# Altium schematic sheet Current_Sensor.SchDoc
size A4; SheetNumber: 4; SheetTotal: 5
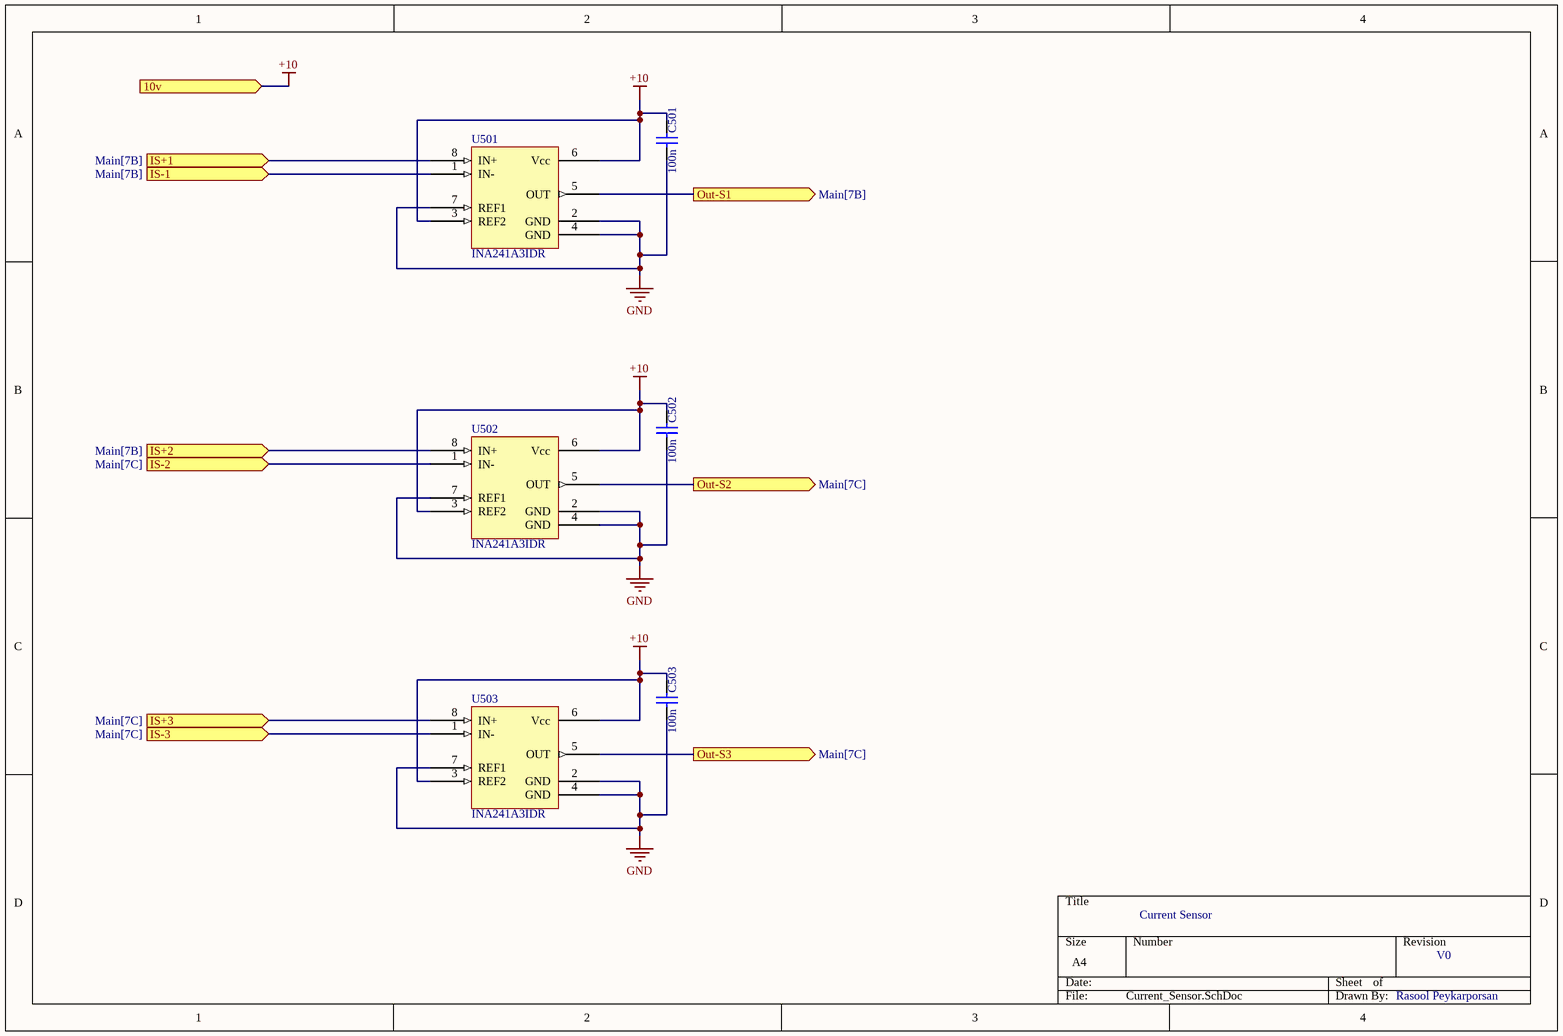
[diagram p0: Current_Sensor.SchDoc]

## Parts
C501  100n  [CAP_1206]
C502  100n  [CAP_1206]
C503  100n  [CAP_1206]
U501  INA241A3IDR  [8SOIC-M]
U502  INA241A3IDR  [8SOIC-M]
U503  INA241A3IDR  [8SOIC-M]

## Ports
10v (in), IS+1 (in, see Main[7B]), IS+2 (in, see Main[7B]), IS+3 (in, see Main[7C]), IS-1 (in, see Main[7B]), IS-2 (in, see Main[7C]), IS-3 (in, see Main[7C]), Out-S1 (out, see Main[7B]), Out-S2 (out, see Main[7C]), Out-S3 (out, see Main[7C])

## Nets
+10: C501.2 C502.2 C503.2 U501.3(REF2) U501.6(Vcc) U502.3(REF2) U502.6(Vcc) U503.3(REF2) U503.6(Vcc) ; port 10v
GND: C501.1 C502.1 C503.1 U501.2(GND) U501.4(GND) U501.7(REF1) U502.2(GND) U502.4(GND) U502.7(REF1) U503.2(GND) U503.4(GND) U503.7(REF1)
IS+1: U501.8(IN+) ; port IS+1
IS+2: U502.8(IN+) ; port IS+2
IS+3: U503.8(IN+) ; port IS+3
IS-1: U501.1(IN-) ; port IS-1
IS-2: U502.1(IN-) ; port IS-2
IS-3: U503.1(IN-) ; port IS-3
Out-S1: U501.5(OUT) ; port Out-S1
Out-S2: U502.5(OUT) ; port Out-S2
Out-S3: U503.5(OUT) ; port Out-S3

## Notes on the sheet
- Current Sensor
- V0
- Rasool Peykarporsan

## Library data of the parts
C501-C503 = CAPN 1206: Non Polarized Capacitor, SMD, 1206
U501-U503 = INA241A3IDR: Current Sense Amplifier 1 Circuit Single-Ended 8-SOIC